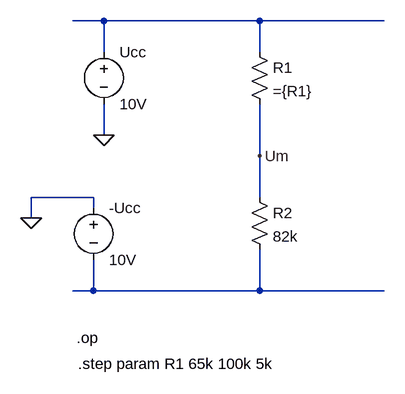
[diagram p0: schematic mostek.asc]
mostek.asc, the LTspice schematic file:
Version 4
SHEET 1 880 680
WIRE 32 48 -16 48
WIRE 272 48 32 48
WIRE 464 48 272 48
WIRE 32 96 32 48
WIRE 272 96 272 48
WIRE 32 224 32 176
WIRE 272 256 272 176
WIRE 16 320 -80 320
WIRE 272 320 272 256
WIRE 16 336 16 320
WIRE -80 352 -80 320
WIRE 16 464 16 416
WIRE 16 464 -16 464
WIRE 272 464 272 400
WIRE 272 464 16 464
WIRE 464 464 272 464
FLAG 32 224 0
FLAG 272 256 Um
FLAG -80 352 0
SYMBOL voltage 32 80 R0
SYMATTR InstName Ucc
SYMATTR Value 10V
SYMBOL res 256 80 R0
SYMATTR InstName R1
SYMATTR Value ={R1}
SYMBOL res 256 304 R0
SYMATTR InstName R2
SYMATTR Value 82k
SYMBOL voltage 16 320 R0
SYMATTR InstName -Ucc
SYMATTR Value 10V
TEXT -10 536 Left 0 !.op
TEXT -8 576 Left 0 !.step param R1 65k 100k 5k

The netlist it stands for:
* mostek.asc
V§Ucc N001 0 10V
R1 N001 Um ={R1}
R2 Um N002 82k
V§-Ucc 0 N002 10V
.op
.step param R1 65k 100k 5k
.backanno
.end

* Results of the author's LTspice run, read from the files saved beside the schematic
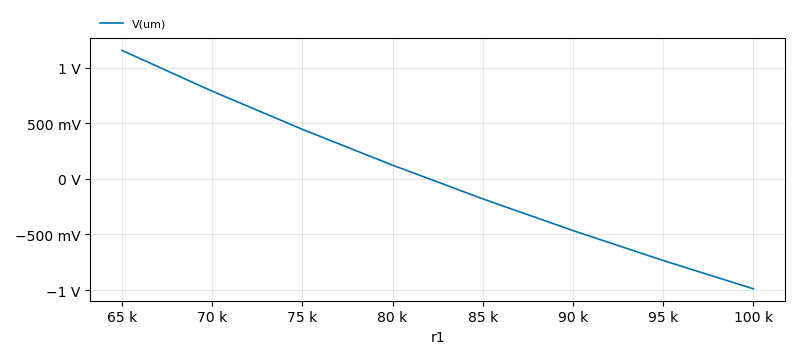
[diagram p1: Operating Point of mostek.asc, plotted from the saved traces]
* Operating Point, 1 run:
*   V(um): 1.156 V at r1=65 k, -989 mV at r1=100 k, min -989 mV, max 1.156 V